# Altium schematic sheet Microcontroller.SchDoc
size A; SheetNumber: 3; SheetTotal: 4
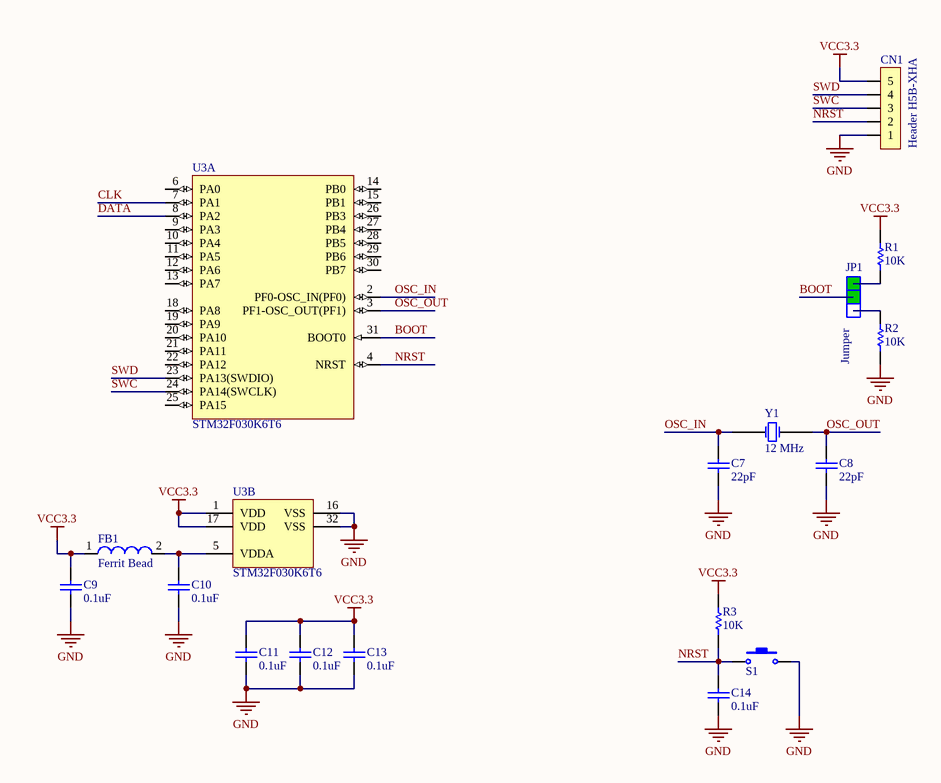
[diagram p0: Microcontroller.SchDoc]

## Parts
C7  22pF  [CAPC4817X12N]
C8  22pF  [CAPC4817X12N]
C9  0.1uF  [CAPC4817X12N]
C10  0.1uF  [CAPC4817X12N]
C11  0.1uF  [CAPC4817X12N]
C12  0.1uF  [CAPC4817X12N]
C13  0.1uF  [CAPC4817X12N]
C14  0.1uF  [CAPC4817X12N]
CN1  Header H5B-XHA  [Header H5B-XHA]
FB1  Ferrit Bead  [1206 Ferrit Bead]
JP1  Jumper  [Jumper Selector SMD]
R1  10K  [RESC4817X04N]
R2  10K  [RESC4817X04N]
R3  10K  [RESC4817X04N]
S1  Switch PB  [Switch - Push to On]  (value not drawn)
U3  STM32F030K6T6  [STM-LQFP32_N]  (parts A,B of 2)
Y1  12 MHz  [Crystal SMD]

## Nets
GND: C7.1 C8.1 C9.1 C10.1 C11.1 C12.1 C13.1 C14.1 CN1.1 R2.1 S1.2 U3.16(VSS) U3.32(VSS)
VCC3.3: C9.2 C11.2 C12.2 C13.2 CN1.5 FB1.1 R1.2 R3.2 U3.1(VDD) U3.17(VDD)
BOOT: JP1.2 U3.31(BOOT0)
CLK: U3.7(PA1)
DATA: U3.8(PA2)
NRST: C14.2 CN1.2 R3.1 S1.1 U3.4(NRST)
OSC_IN: C7.2 U3.2(PF0-OSC_IN(PF0)) Y1.1(OSC1)
OSC_OUT: C8.2 U3.3(PF1-OSC_OUT(PF1)) Y1.2(OSC2)
SWC: CN1.3 U3.24(PA14(SWCLK))
SWD: CN1.4 U3.23(PA13(SWDIO))
NetC10_2: C10.2 FB1.2 U3.5(VDDA)
NetJP1_1: JP1.1 R1.1
NetJP1_3: JP1.3 R2.2

Not connected (* = marked no-connect by the designer): U3 6(PA0) 9(PA3) 10(PA4) 11(PA5) 12(PA6) 13(PA7) 14(PB0) 15(PB1) 18(PA8) 19(PA9) 20(PA10) 21(PA11) 22(PA12) 25(PA15) 26(PB3) 27(PB4) 28(PB5) 29(PB6) 30(PB7)

## Library data of the parts
C7-C14 = CAP SMD 1206: CAP 1206; Designer: Abbas Basereh; Desc.: CAP SMD 1206; Data: 16-12-2016
JP1 = Jumper Selector
R1-R3 = RES 1206 0.25W: RES 1206; Designer: Abbas Basereh; Desc.: RES SMD 1206; Data: 16-12-2016
S1 = Switch PB: Push Button Switch
U3 = STM32F030K6T6: ARM Cortex-M0 32-bit MCU, 32 KB Flash, 4 KB Internal RAM, 26 I/Os, 32-pin LQFP, -40 to 85 degC, Tray; FLASH Size (Prog) (kB): 32; I/Os (High Current): 26; Internal RAM Size (kB): 4; Operating Frequency(F) (Processor speed) (MHz): 48; Supply Voltage(Vcc) min (V): 2.4; DatasheetVersion: Rev. 1; PackageVersion: Rev. 1, 07/2013; PackageReference: LQFP32; PackageDescription: 32-Pin Low Profile Quad Flat Package, 7 x 7 mm Body, 0.8 mm Pitch; Supplier 1: Digi-Key; Supplier Part Number 1: 497-14046-ND; Supplier 2: Newark; Supplier Part Number 2: 19X6194; Supplier 3: Mouser; Supplier Part Number 3: 511-STM32F030K6T6; Core: ARM Cortex-M0; Packing: Tray; Mounting Technology: Surface Mount; PartNumber: STM32F030K6T6; ComponentLink1Description: Manufacturer URL; ComponentLink1URL: http://www.st.com/web/en/home.html; ComponentLink2Description: Datasheet; ComponentLink2URL: http://www.st.com/st-web-ui/static/active/en/resource/technical/document/datasheet/DM00088500.pdf; ComponentLink3Description: Package Specification; ComponentLink3URL: http://www.st.com/st-web-ui/static/active/en/resource/technical/document/datasheet/DM00088500.pdf
Y1 = XTAL_Crystal: XTAL Crystal; Designer: ABBAS BASEREH; Design Date: 2017-1-3; ComponentLink1Description: Datasheet; ComponentLink2Description: Reference; Mounting Technology: Surface Mount\Through-Hole; Value: 12 MHz; Status: Unreleased